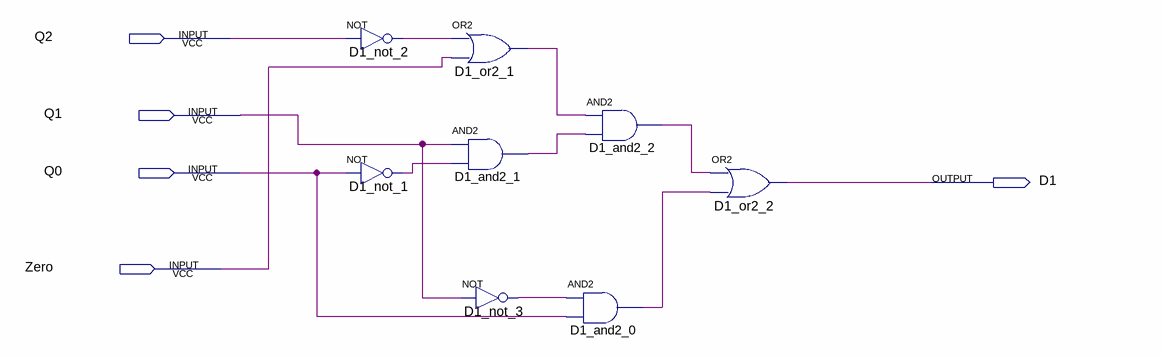
[diagram p0: schematic sheet]
// Quartus schematic D1_control.bdf as structural Verilog: 8 symbols, 5 pins
module D1_control (
  input  Q2,
  input  Q1,
  input  Q0,
  input  Zero,
  output D1
);

  wire D1_and2_0_out, D1_and2_1_out, D1_and2_2_out, D1_not_1_out, D1_not_2_out, D1_not_3_out, D1_or2_1_out;

  not D1_not_2 (D1_not_2_out, Q2);
  not D1_not_1 (D1_not_1_out, Q0);
  or D1_or2_1 (D1_or2_1_out, D1_not_2_out, Zero);
  and D1_and2_1 (D1_and2_1_out, Q1, D1_not_1_out);
  not D1_not_3 (D1_not_3_out, Q1);
  and D1_and2_0 (D1_and2_0_out, D1_not_3_out, Q0);
  and D1_and2_2 (D1_and2_2_out, D1_or2_1_out, D1_and2_1_out);
  or D1_or2_2 (D1, D1_and2_2_out, D1_and2_0_out);
endmodule
